# EAGLE design ln2block_6s (EAGLE 7.6.0)
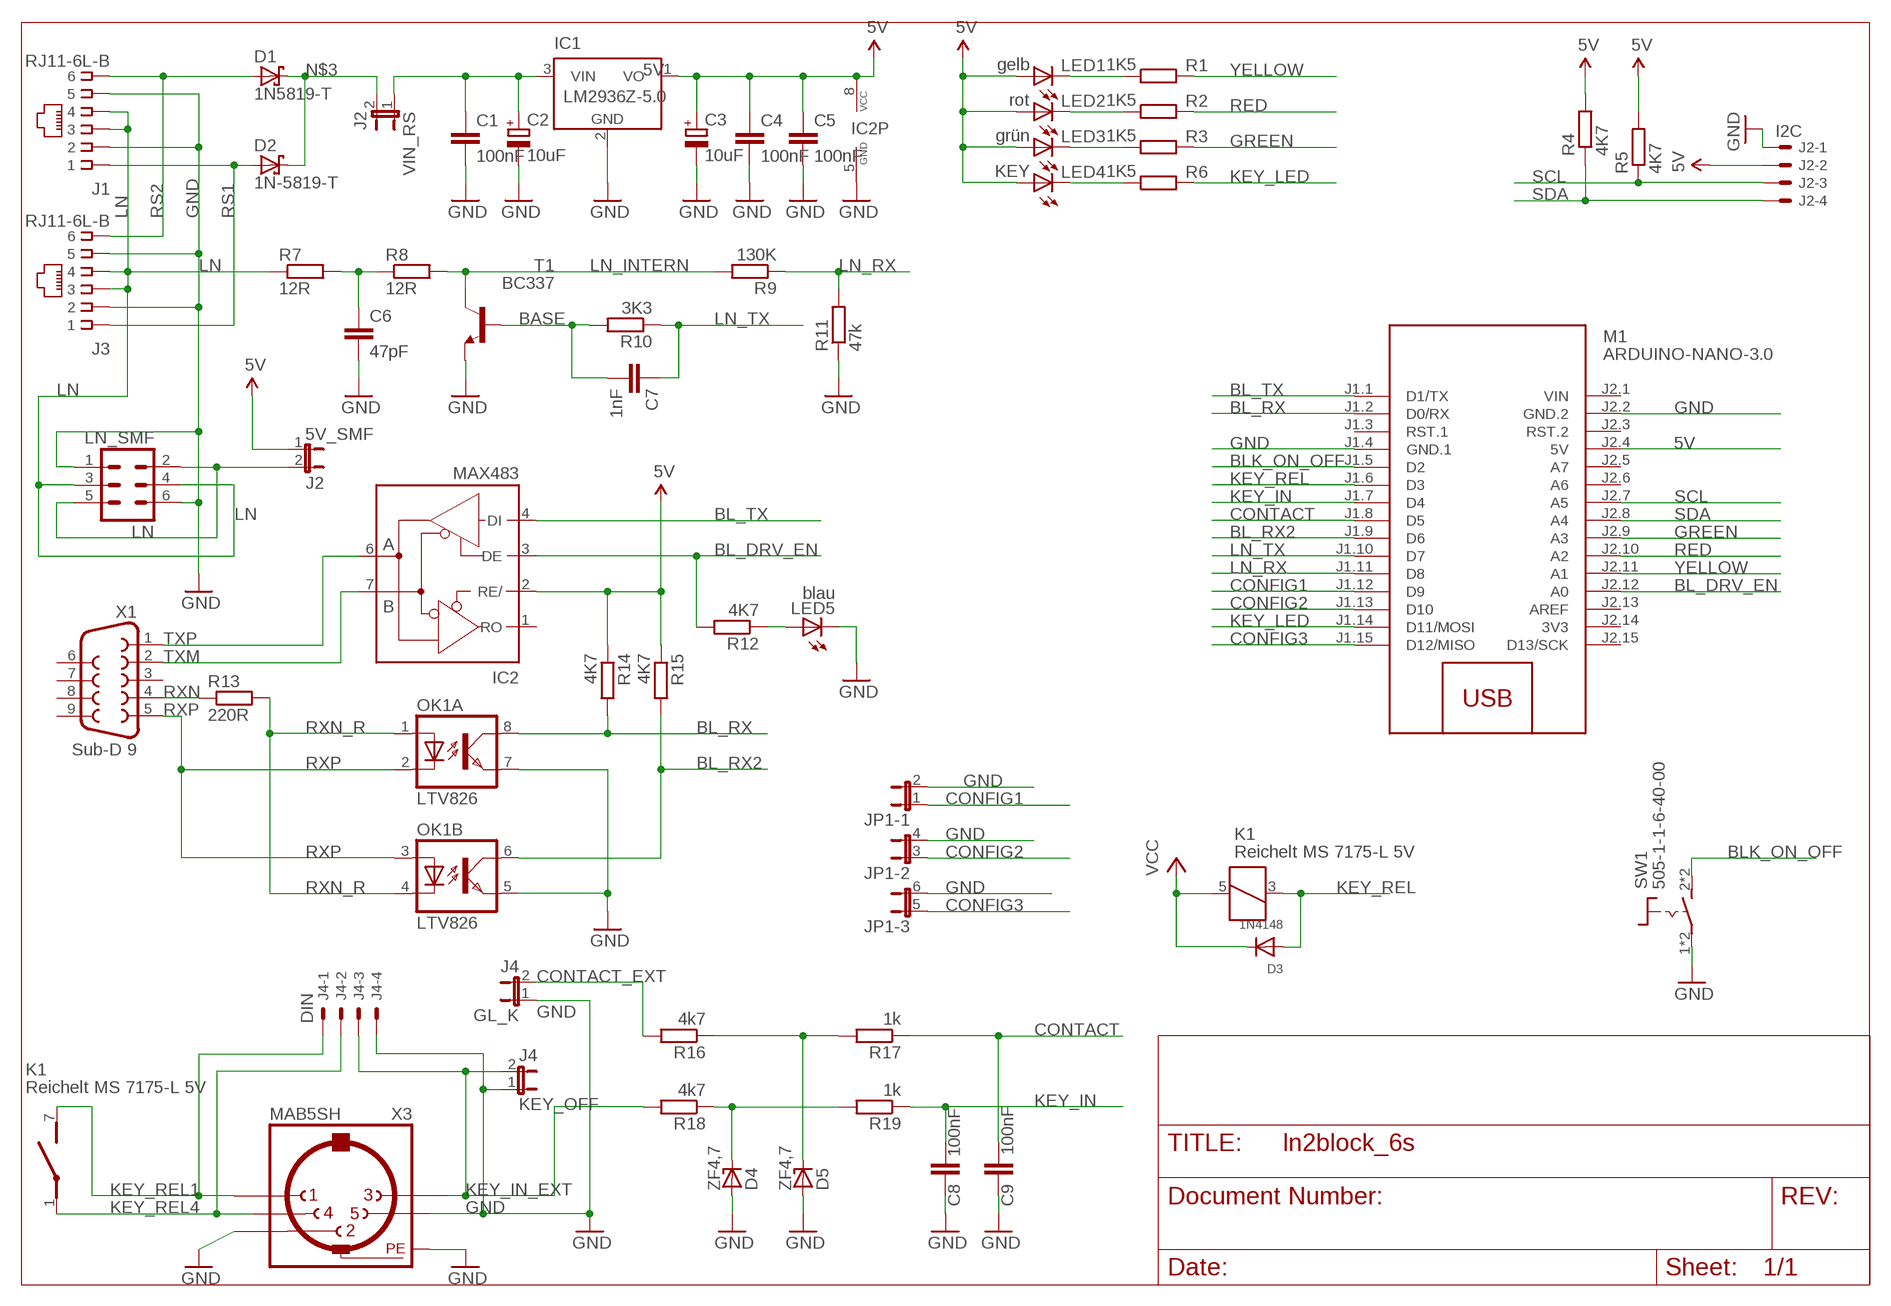
[diagram p0: schematic, sheet 1]

## Parts
5V_SMF  J2  JP1E  [JP1]
C1  100nF  C-EU025-025X050  [C025-025X050]
C2  10uF  CPOL-EUE2.5-5  [E2,5-5]
C3  10uF  CPOL-EUE2.5-5  [E2,5-5]
C4  100nF  C-EU025-025X050  [C025-025X050]
C5  100nF  C-EU025-025X050  [C025-025X050]
C6  47pF  C-EU025-024X044  [C025-024X044]
C7  1nF  C-EU025-025X050  [C025-025X050]
C8  100nF  C-EU025-025X050  [C025-025X050]
C9  100nF  C-EU025-025X050  [C025-025X050]
D1  1N5819-T  [DO41-7.6]
D2  1N-5819-T  1N5819-T  [DO41-7.6]
D3  1N4148  DIODEDO-1N4148  [DO-1N4148]
D4  ZF4,7  ZENER-DIODEZD-7.5  [ZDIO-7.5]
D5  ZF4,7  ZENER-DIODEZD-7.5  [ZDIO-7.5]
GL_K  J4  JP1E  [JP1]
IC1  LM2936Z-5.0  [TO92]
IC2  MAX483  MAX481CPA  [DIL08]
J1  RJ11-6L-B  [RJ11-NO_SHIELD]
J2  I2C  22-27-2041-04  [6410-04]
J3  RJ11-6L-B  [RJ11-NO_SHIELD]
J4  DIN  22-27-2041-04  [6410-04]
JP1  JP3QE  [JP3Q]
K1  Reichelt MS 7175-L 5V  MEDER_MSVV_1A87-75  [MEDER_MS_1A87-75L]
KEY_OFF  J4  JP1E  [JP1]
LED1  gelb  LED3MM  [LED3MM]
LED2  rot  LED3MM  [LED3MM]
LED3  grün  LED3MM  [LED3MM]
LED4  KEY  LED3MM  [LED3MM]
LED5  blau  LED3MM  [LED3MM]
LN  LN_SMF  CON-HARTING-ML_ML6  [CON-HARTING-ML_ML6]
M1  ARDUINO-NANO-3.0  [ARDUINO-NANO-3.0]
OK1  LTV826  [DIL08]
R1  1K5  R-EU_0207/7  [0207/7]
R2  1K5  R-EU_0207/7  [0207/7]
R3  1K5  R-EU_0207/7  [0207/7]
R4  4K7  R-EU_0207/7  [0207/7]
R5  4K7  R-EU_0207/7  [0207/7]
R6  1K5  R-EU_0207/7  [0207/7]
R7  12R  R-EU_0207/7  [0207/7]
R8  12R  R-EU_0207/7  [0207/7]
R9  130K  R-EU_0207/7  [0207/7]
R10  3K3  R-EU_0207/7  [0207/7]
R11  47k  R-EU_0207/7  [0207/7]
R12  4K7  R-EU_0207/7  [0207/7]
R13  220R  R-EU_0207/7  [0207/7]
R14  4K7  R-EU_0207/7  [0207/7]
R15  4K7  R-EU_0207/7  [0207/7]
R16  4k7  R-EU_0207/7  [0207/7]
R17  1k  R-EU_0207/7  [0207/7]
R18  4k7  R-EU_0207/7  [0207/7]
R19  1k  R-EU_0207/7  [0207/7]
SW1  505-1-1-6-40-00  TACTILE_SWITCH_505-1-1-6-40-00_6X6MM  [WS-TATV]
T1  BC337  [TO92]
VIN_RS  J2  JP1E  [JP1]
X1  Sub-D 9  F09HP  [F09HP]
X3  MAB5SH  [MAB5SH]

## Nets
5V: 5V_SMF.1 C3.+ C4.1 C5.1 D3.C IC1.1(VO) IC2.2(RE/) IC2.8(VCC) J2.2 K1.5 LED1.A LED2.A LED3.A LED4.A M1.J2.4(5V) R4.2 R5.2 R14.1 R15.1 ; supply symbol labelled VCC
BASE: C7.2 R10.2 T1.2(B)
BL_DRV_EN: IC2.3(DE) M1.J2.12(A0) R12.2
BL_RX: M1.J1.2(D0/RX) OK1.8(A:COL) R14.2
BL_RX2: M1.J1.9(D6) OK1.6(B:COL) R15.2
BL_TX: IC2.4(DI) M1.J1.1(D1/TX)
BLK_ON_OFF: M1.J1.5(D2) SW1.2(S) SW1.4(S)
CONFIG1: JP1.1 M1.J1.12(D9)
CONFIG2: JP1.3 M1.J1.13(D10)
CONFIG3: JP1.5 M1.J1.15(D12/MISO)
CONTACT: C9.2 M1.J1.8(D5) R17.1
CONTACT_EXT: GL_K.2 R16.2
GND: C1.2 C2.- C3.- C4.2 C5.2 C6.2 C8.1 C9.1 D4.A D5.A GL_K.1 IC1.2(GND) IC2.5(GND) J1.2 J1.5 J2.1 J3.2 J3.5 J4.4 JP1.2 JP1.4 JP1.6 KEY_OFF.1 LED5.K(C) LN.1 LN.6 M1.J1.4(GND.1) M1.J2.2(GND.2) OK1.5(B:EMIT) OK1.7(A:EMIT) R11.1 SW1.1(P) SW1.3(P) T1.1(E) X3.5 X3.PE X3.PE1(PE) X3.PE2(PE) X3.PE@(PE)
GREEN: M1.J2.9(A3) R3.2
KEY_IN: C8.2 M1.J1.7(D4) R19.1
KEY_IN_EXT: J4.3 KEY_OFF.2 R18.2 X3.3
KEY_LED: M1.J1.14(D11/MOSI) R6.2
KEY_REL: D3.A K1.3 M1.J1.6(D3)
KEY_REL1: J4.1 K1.7(2:S) X3.1
KEY_REL4: J4.2 K1.1(2:P) X3.4
LN: J1.3 J1.4 J3.3 J3.4 LN.3 LN.4 R7.1
LN_INTERN: R8.2 R9.2 T1.3(C)
LN_PLUS: C1.1 C2.+ IC1.3(VIN) VIN_RS.1
LN_RX: M1.J1.11(D8) R9.1 R11.2
LN_TX: C7.1 M1.J1.10(D7) R10.1
N$1: LED4.K(C) R6.1
N$2: LED5.A R12.1
N$3: D1.C D2.C VIN_RS.2
N$4: 5V_SMF.2 LN.2 LN.5
N$6: D4.C R18.1 R19.2
N$7: C6.1 R7.2 R8.1
N$8: D5.C R16.1 R17.2
N$21: LED1.K(C) R1.1
N$23: LED2.K(C) R2.1
N$24: LED3.K(C) R3.1
RED: M1.J2.10(A2) R2.2
RS1: D2.A J1.1 J3.1
RS2: D1.A J1.6 J3.6
RXN: R13.1 X1.4
RXN_R: OK1.1(A:A) OK1.4(B:C) R13.2
RXP: OK1.2(A:C) OK1.3(B:A) X1.5
SCL: J2.3 M1.J2.7(A5) R5.1
SDA: J2.4 M1.J2.8(A4) R4.1
TXM: IC2.7(B) X1.2
TXP: IC2.6(A) X1.1
YELLOW: M1.J2.11(A1) R1.2
Unconnected: IC2.1(RO) M1.J1.3(RST.1) M1.J2.3(RST.2) M1.J2.5(A7) M1.J2.6(A6) M1.J2.13(AREF) M1.J2.15(D13/SCK) X1.3 X1.6 X1.7 X1.8 X1.9 X3.2

## Power pins joined to a net without a drawn wire
3V3: M1.J2.14(3V3)
VIN: M1.J2.1(VIN)

## Library data of the parts
5V_SMF GL_K KEY_OFF VIN_RS = jumper:JP1E: JUMPER
C1 C4-C9 = resistor:C-EU: CAPACITOR, European symbol
C2 C3 = resistor:CPOL-EU: POLARIZED CAPACITOR, European symbol
D1 D2 = diode:1N581*: 1.0A SCHOTTKY BARRIER RECTIFIER Source: http://www.diodes.com/datasheets/ds23001.pdf
D3 = adafruit:DIODE: Diode SMADIODE - SMA Surface Mount Package 20V 1A Schottky Diode Digikey: 641-1014-6-ND DO-1N4148 - Through Hole Small Current Diode SOD-123 20V 1 A (.5mV Vf) Schottky Diode - Digikey: MBRX120TPMSCT-ND SOD-323 10V 570mA (.38mV Vf, 3ns) Schottky Diode - Digikey: ZLLS410CT-ND SOD-523 30V 30mA Schottky Diode (RB751S-40TE61) - Digikey: RB751S-40TE61CT-ND SOT23-R/W - SOT23 Package (R = Solder Paste/Reflow Ovens, W = Hand-Soldering) BAT54Film 40V 300mA - Digikey: 497-7162-1-ND
D4 D5 = diode:ZENER-DIODE: Z-Diode
IC1 = national-semiconductor:LM2936?*: Ultra-Low Quiescent Current LDO Voltage Regulator Source: Data sheet <http://www.national.com/ds/LM/LM2936.pdf>; MF: NATIONAL SEMICONDUCTOR; MPN: LM2936Z-5.0/NOPB; OC_FARNELL: 1150143; OC_NEWARK: 41K4533
IC2 = maxim:MAX481CPA: RS485 TRANSEIVER; MPN: MAX481CPA+; OC_FARNELL: unknown; OC_NEWARK: 99K3445
J1 J3 = con-tycoelectronics:RJ11: CORCOM Modular RJ Jacks No Shield Source: www.tycoelectronics.com .. ENG_DS_1654001_1099_RJ_L_0507.pdf; MF: TYCO ELECTRONICS; MPN: RJ11-6L-B; OC_FARNELL: unknown; OC_NEWARK: 52K3613
J2 J4 = con-molex:22-?-04: CONNECTOR wire to board 2.54 mm (.1 inch) pitch header; OC_FARNELL: unknown; OC_NEWARK: unknown
JP1 = jumper:JP3QE: JUMPER
K1 = sbor:MEDER_MSVV_1A87-75: RELAY reed, 1 x norm. open with polarity; OC_FARNELL: unknown; OC_NEWARK: unknown
LED1-LED5 = led:LED: LED OSRAM: - CHIPLED LG R971, LG N971, LY N971, LG Q971, LY Q971, LO R971, LY R971 LH N974, LH R974 LS Q976, LO Q976, LY Q976 LO Q996 - Hyper CHIPLED LW Q18S LB Q993, LB Q99A, LB R99A - SideLED LS A670, LO A670, LY A670, LG A670, LP A670 LB A673, LV A673, LT A673, LW A673 LH A674 LY A675 LS A676, LA A676, LO A676, LY A676, LW A676 LS A679, LY A679, LG A679 - Hyper Micro SIDELED® LS Y876, LA Y876, LO Y876, LY Y876 LT Y87S - SmartLED LW L88C, LW L88S LB L89C, LB L89S, LG L890 LS L89K, LO L89K, LY L89K LS L896, LA L896, LO L896, LY L896 - TOPLED LS T670, LO T670, LY T670, LG T670, LP T670 LSG T670, LSP T670, LSY T670, LOP T670, LYG T670 LG T671, LOG T671, LSG T671 LB T673, LV T673, LT T673, LW T673 LH T674 LS T676, LA T676, LO T676, LY T676, LB T676, LH T676, LSB T676, LW T676 LB T67C, LV T67C, LT T67C, LS T67K, LO T67K, LY T67K, LW E67C LS E67B, LA E67B, LO E67B, LY E67B, LB E67C, LV E67C, LT E67C LW T67C LS T679, LY T679, LG T679 LS T770, LO T770, LY T770, LG T770, LP T770 LB T773, LV T773, LT T773, LW T773 LH T774 LS E675, LA E675, LY E675, LS T675 LS T776, LA T776, LO T776, LY T776, LB T776 LHGB T686 LT T68C, LB T68C - Hyper Mini TOPLED® LB M676 - Mini TOPLED Santana® LG M470 LS M47K, LO M47K, LY M47K Source: http://www.osram.convergy.de LUXEON: - LUMILED® LXK2-PW12-R00, LXK2-PW12-S00, LXK2-PW14-U00, LXK2-PW14-V00 LXK2-PM12-R00, LXK2-PM12-S00, LXK2-PM14-U00 LXK2-PE12-Q00, LXK2-PE12-R00, LXK2-PE12-S00, LXK2-PE14-T00, LXK2-PE14-U00 LXK2-PB12-K00, LXK2-PB12-L00, LXK2-PB12-M00, LXK2-PB14-N00, LXK2-PB14-P00, LXK2-PB14-Q00 LXK2-PR12-L00, LXK2-PR12-M00, LXK2-PR14-Q00, LXK2-PR14-R00 LXK2-PD12-Q00, LXK2-PD12-R00, LXK2-PD12-S00 LXK2-PH12-R00, LXK2-PH12-S00 LXK2-PL12-P00, LXK2-PL12-Q00, LXK2-PL12-R00 Source: www.luxeon.com KINGBRIGHT: KA-3528ASYC Source: www.kingbright.com
LN = _relaisblock2Gl-Frontplatte:CON-HARTING-ML_ML6: HARTING
M1 = diy-modules:ARDUINO-NANO-3.0: Arduino Nano 3.0
OK1 = optocoupler:LTV826: OPTO COUPLER Source: LITEON, LTV816.pdf; OC_FARNELL: unknown; OC_NEWARK: unknown
R1-R19 = resistor:R-EU_: RESISTOR, European symbol
SW1 = fredi:TACTILE_SWITCH: Tactile Switch; BE#: 1144
T1 = transistor:BC337: NPN TRANSISTOR
X1 = con-subd:F09: SUB-D; OC_FARNELL: unknown; OC_NEWARK: unknown
X3 = _djk:MAB5SH: Female CONNECTOR 5 pins 90 deg. with shield, horizontal (DIN 41524); OC_FARNELL: 809883; OC_NEWARK: unknown

## Board
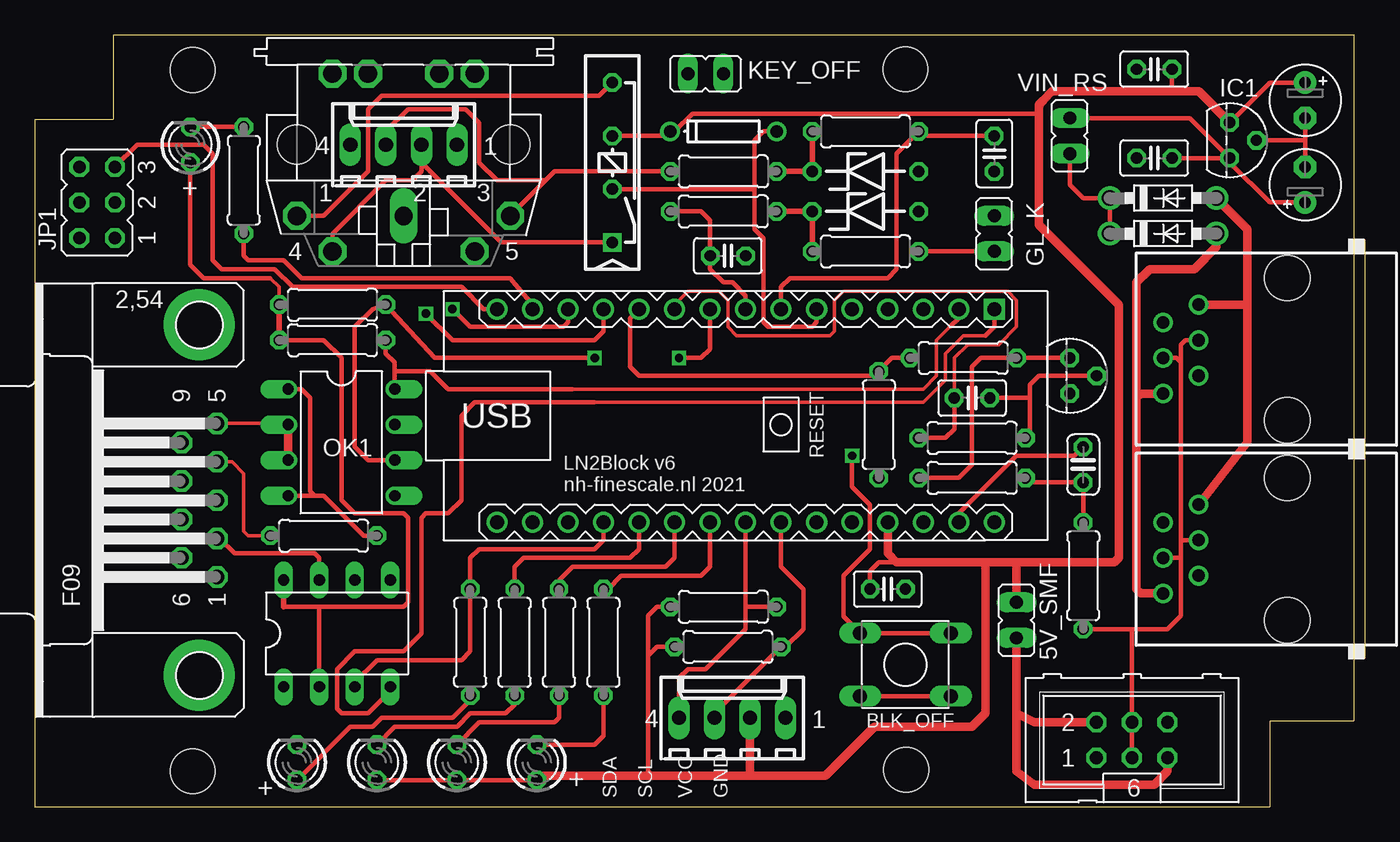
[diagram p1: board, top side]
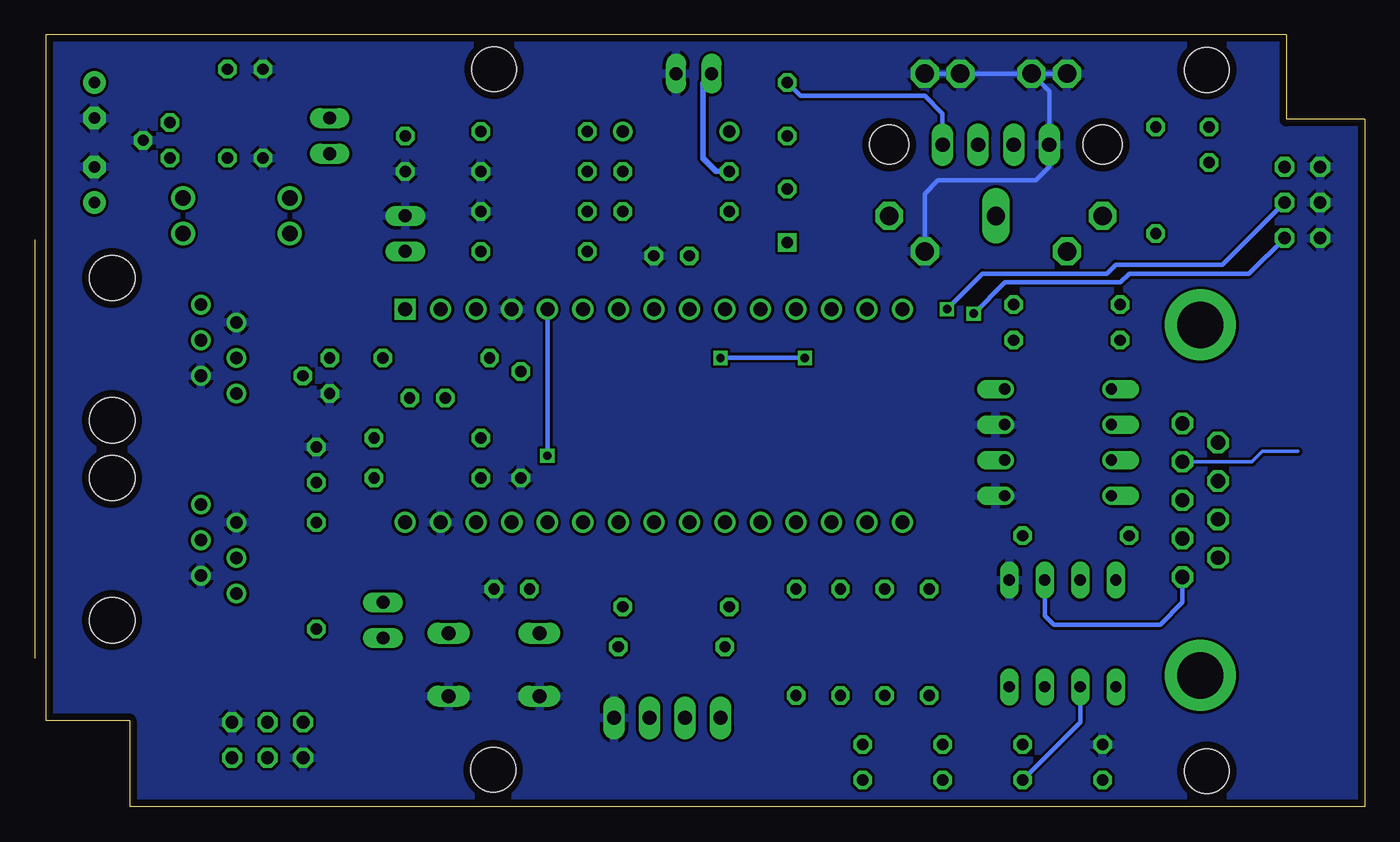
[diagram p2: board, bottom side, seen from below]

Size 94.28 x 55.15 mm. Coordinates in mm from the lower left corner, seen from the top.
Outline: 0,0 88.28,0 88.28,6.15 94.28,6.15 94.28,55.15 5.59,55.15 5.59,49.12 0,49.12 0,0
Copper layers (1*16): Top 0.035mm / dielectric 1.5mm / Bottom 0.035mm
Design rules "dj-eagle": minimum track width 10mil, minimum drill 20mil, track to track 8mil, track to pad 8mil, pad to pad 8mil, via to via 8mil, smd to smd 8mil, copper to edge 20mil, drill to drill 8mil, minimum pad ring 10mil, minimum via ring 8mil, stop-mask expansion 4mil, vias tented up to drill 0mil, thermal gap 10mil
Holes 3.2 mm at 62.28,2.65 62.23,52.7 11.29,2.54 11.29,52.65

### Footprints (pad centres in the part's own frame; a part is rotated, then mirrored left to right if it is on the bottom)
JP1 = drill 0.914 long: 1 0,-1.27; 2 0,1.27
C025-025X050 = drill 0.813 octagon: 1 -1.27,0; 2 1.27,0
E2,5-5 = drill 0.813 pad 1.6: + -1.27,0 | drill 0.813 pad 1.6 octagon: - 1.27,0
C025-024X044 = drill 0.813 octagon: 1 -1.27,0; 2 1.27,0
DO41-7.6 = drill 1.1 pad 1.7: A 3.81,0; C -3.81,0
DO-1N4148 = drill 0.9: A -3.81,0; C 3.81,0
ZDIO-7.5 = drill 0.813 octagon: A 3.81,0; C -3.81,0
TO92 = drill 0.813 pad 1.27 octagon: 1 -1.27,0; 2 0,1.905; 3 1.27,0
DIL08 = drill 0.813 long: 1 -3.81,-3.81; 2 -1.27,-3.81; 3 1.27,-3.81; 4 3.81,-3.81; 5 3.81,3.81; 6 1.27,3.81; 7 -1.27,3.81; 8 -3.81,3.81
RJ11-NO_SHIELD = drill 0.9 pad 1.4: 1 -3.175,8.89; 2 -1.905,6.35; 3 -0.635,8.89; 4 0.635,6.35; 5 1.905,8.89; 6 3.175,6.35 | hole 3.251: -5.08,0; 5.08,0
6410-04 = drill 1.016 long: 1 3.81,0; 2 1.27,0; 3 -1.27,0; 4 -3.81,0
JP3Q = drill 0.914 octagon: 1 -2.54,-1.27; 2 -2.54,1.27; 3 0,-1.27; 4 0,1.27; 5 2.54,-1.27; 6 2.54,1.27
MEDER_MS_1A87-75L = drill 0.813 square: 1 0,0 | drill 0.813 octagon: 3 3.81,0; 5 7.62,0; 7 11.43,0
LED3MM = drill 0.813 octagon: A -1.27,0; K 1.27,0
CON-HARTING-ML_ML6 = drill 0.914 octagon: 1 -2.54,-1.27; 2 -2.54,1.27; 3 0,-1.27; 4 0,1.27; 5 2.54,-1.27; 6 2.54,1.27
ARDUINO-NANO-3.0 = drill 1 square: J1.1 17.78,7.62 | drill 1: J1.2 15.24,7.62; J1.3 12.7,7.62; J1.4 10.16,7.62; J1.5 7.62,7.62; J1.6 5.08,7.62; J1.7 2.54,7.62; J1.8 0,7.62; J1.9 -2.54,7.62; J1.10 -5.08,7.62; J1.11 -7.62,7.62; J1.12 -10.16,7.62; J1.13 -12.7,7.62; J1.14 -15.24,7.62; J1.15 -17.78,7.62; J2.1 17.78,-7.62; J2.2 15.24,-7.62; J2.3 12.7,-7.62; J2.4 10.16,-7.62; J2.5 7.62,-7.62; J2.6 5.08,-7.62; J2.7 2.54,-7.62; J2.8 0,-7.62; J2.9 -2.54,-7.62; J2.10 -5.08,-7.62; J2.11 -7.62,-7.62; J2.12 -10.16,-7.62; J2.13 -12.7,-7.62; J2.14 -15.24,-7.62; J2.15 -17.78,-7.62
DIL08' = drill 0.813 offset: 1 -3.81,-3.81; 2 -1.27,-3.81; 3 1.27,-3.81; 4 3.81,-3.81; 5 3.81,3.81; 6 1.27,3.81; 7 -1.27,3.81; 8 -3.81,3.81
0207/7 = drill 0.813 octagon: 1 -3.81,0; 2 3.81,0
WS-TATV = drill 1 long: 1 -3.25,2.25; 2 -3.25,-2.25; 3 3.25,2.25; 4 3.25,-2.25
TO92' = drill 0.813 octagon: 1 1.27,0; 2 0,1.905; 3 -1.27,0
F09HP = drill 1.016 octagon: 1 -5.486,-1.27; 2 -2.743,-1.27; 3 0,-1.27; 4 2.743,-1.27; 5 5.486,-1.27; 6 -4.115,1.27; 7 -1.372,1.27; 8 1.372,1.27; 9 4.115,1.27 | drill 3.302 pad 5.08: G1 -12.522,0; G2 12.522,0
MAB5SH = drill 1.321 octagon: 1 7.62,5.08; 3 -7.62,5.08; 4 5.08,7.62; 5 -5.08,7.62; PE -2.54,-5.08; PE1 -5.08,-5.08; PE2 5.08,-5.08; PE@ 2.54,-5.08 | drill 1.321 long: 2 0,5.08 | hole 2.794: 7.62,0; -7.62,0

### Placement (x,y rotation side)
5V_SMF  70.17,13.33 180 top
C1  80.01,46.35 180 top
C2  90.8,44.45 90 top
C3  90.8,50.48 270 top
C4  80.01,52.7 180 top
C5  60.96,15.56 0 top
C6  74.93,24.45 90 top
C7  66.99,29.21 0 top
C8  68.58,46.67 90 top
C9  49.53,39.37 180 top
D1  80.64,43.5 0 top
D2  80.64,40.96 0 top
D3  49.21,48.26 180 top
D4  59.37,45.4 0 top
D5  59.37,42.55 0 top
GL_K  68.58,40.96 180 top
IC1  85.41,47.62 270 top
IC2  21.59,12.38 0 top
J1  89.53,32.7 90 top
J2  49.85,6.35 0 top
J3  89.53,18.41 90 top
J4  26.35,47.31 0 top
JP1  4.45,43.18 90 top
K1  41.28,40.32 90 top
KEY_OFF  47.94,52.39 90 top
LED1  24.45,3.18 90 top
LED2  30.16,3.18 90 top
LED3  35.88,3.18 90 top
LED4  11.11,47.31 90 top
LED5  18.73,3.18 90 top
LN  78.42,4.76 0 top
M1  50.8,27.94 0 top
OK1  LTV826  [DIL08']  21.91,26.03 270 top
R1  34.29,11.75 90 top
R2  37.47,11.75 90 top
R3  40.64,11.75 90 top
R4  49.21,14.29 180 top
R5  49.53,11.43 180 top
R6  14.92,44.77 270 top
R7  74.93,16.51 90 top
R8  66.99,23.49 180 top
R9  66.36,32.07 0 top
R10  66.99,26.35 0 top
R11  60.33,27.3 90 top
R12  31.11,11.75 90 top
R13  20.64,19.37 0 top
R14  21.27,33.34 0 top
R15  21.27,35.88 0 top
R16  59.37,39.69 0 top
R17  49.21,42.55 0 top
R18  49.21,45.4 180 top
R19  59.37,48.26 180 top
SW1  62.23,10.16 180 top
T1  BC337  [TO92']  73.98,30.8 270 top
VIN_RS  73.98,47.94 180 top
X1  11.75,21.91 90 top
X3  26.35,47.31 180 top

### Tracks (layer width: path | path; a pad name or v marks a point on that pad's centre or on a via)
5V
  Top 0.254: 16.83,37.78 17.46,37.15 R15.1
  Top 0.305: LED1.A LED2.A LED3.A | C3.+ 88.27,51.75 IC1.1 | C4.1 81.28,51.12 | K1.5 44.77,47.94 D3.C 45.72,48.26 46.99,49.53 71.75,49.53 72.07,50.48 73.02,51.12 | R14.1 20.64,33.34 21.91,32.07 21.91,21.91 22.86,20.95 26.35,20.95 26.67,20.64 26.67,14.6 26.35,14.29 20.32,14.29 | 20.32,14.29 17.78,14.29 | IC2.2 20.32,14.29 | 61.59,17.46 60.33,17.46 59.69,16.83 C5.1 | LED4.A 11.11,38.73 12.07,37.78 16.83,37.78 | R5.2 44.45,11.43 43.81,10.79 | 43.81,10.79 43.81,2.54 44.13,2.22 | R4.2 44.45,14.29 43.81,13.65 43.81,10.79
  Top 0.406: R15.1 R14.1 | IC2.8 17.78,14.29
  Top 0.61: 67.94,17.46 70.17,17.46 | 70.17,17.46 77.15,17.46 77.47,17.78 77.47,35.88 71.75,41.59 71.75,49.53 71.75,50.16 72.07,50.48 72.71,51.12 73.02,51.12 81.28,51.12 83.19,51.12 IC1.1 | 5V_SMF.1 70.17,17.46 | 51.12,2.22 44.13,2.22 36.19,2.22 LED3.A | 51.12,2.22 56.52,2.22 60.01,5.71 66.99,5.71 67.94,6.67 67.94,17.46 | 67.94,17.46 61.59,17.46 60.96,18.1 M1.J2.4 | J2.2 51.12,2.22
  Bottom 0.305: IC2.2 20.32,6.03 LED1.A
BASE
  Top 0.305: T1.2 71.75,30.8 71.12,30.16 71.12,29.21 | 71.12,29.21 71.12,26.67 R10.2 | C7.2 71.12,29.21
BL_DRV_EN
  Top 0.305: IC2.3 22.86,8.89 24.45,10.48 30.48,10.48 31.11,11.11 R12.2 31.11,17.78 31.75,18.41 40,18.41 40.64,19.05 M1.J2.12
BL_RX
  Top 0.254: 38.42,29.84 63.5,29.84 64.45,30.8 64.45,33.34 65.41,34.29
  Top 0.305: 65.41,34.29 66.04,34.92 M1.J1.2 | R14.2 25.08,32.38 25.72,31.75 25.72,31.12 | 25.72,31.12 OK1.8 | 38.42,29.84 29.53,29.84 28.26,31.12 25.72,31.12
BL_RX2  (via drill 0.6)
  Top 0.305: OK1.6 23.81,24.77 22.86,25.72 22.86,34.29 24.13,35.56 R15.2 28.57,32.07 v40,32.07 | v46.04,32.07 47.62,32.07 48.26,32.7 M1.J1.9
  Bottom 0.305: v40,32.07 v46.04,32.07
BL_TX
  Top 0.254: 67.94,33.66 66.36,33.66 65.09,32.38 65.09,30.48 63.5,28.89 40,28.89
  Top 0.305: 40,28.89 31.43,28.89 30.48,27.94 30.48,21.91 29.53,20.95 27.94,20.95 27.62,20.64 27.62,12.38 26.35,11.11 22.86,11.11 21.59,9.84 21.59,6.99 21.91,6.67 23.81,6.67 25.4,8.26 IC2.4 | 67.94,33.66 68.58,34.29 M1.J1.1
BLK_ON_OFF  (via drill 0.6)
  Top 0.305: v58.42,25.08 58.42,22.86 59.69,21.59 59.69,18.41 57.78,16.51 57.78,13.6 SW1.4 SW1.2
  Bottom 0.305: M1.J1.5 v58.42,25.08
CONFIG1  (via drill 0.6)
  Top 0.305: v27.94,35.24 29.85,33.34 40,33.34 40.64,33.97 M1.J1.12
  Bottom 0.305: v27.94,35.24 25.72,37.46 17.46,37.46 16.83,38.1 8.26,38.1 JP1.1
CONFIG2  (via drill 0.6)
  Top 0.305: M1.J1.13 38.1,34.61 37.78,34.29 31.11,34.29 v29.85,35.56
  Bottom 0.305: v29.85,35.56 27.31,38.1 18.41,38.1 17.78,38.73 10.16,38.73 JP1.3
CONFIG3
  Top 0.305: M1.J1.15 32.07,35.56 30.48,37.15 18.41,37.15 17.14,38.42 13.34,38.42 12.7,39.05 12.7,46.67 12.07,47.31 7.3,47.31 JP1.5
CONTACT
  Top 0.305: R17.1 47.62,42.55 48.26,41.91 C9.2 48.26,38.42 49.21,37.46 49.85,37.46 50.8,36.51 M1.J1.8
CONTACT_EXT
  Top 0.305: R16.2 GL_K.2
GND
  Top 0.305: 66.04,20.95 70.17,25.08 74.3,25.08 C6.2 | SW1.3 SW1.1 | C3.- 90.8,47.62 | 90.8,47.62 C2.- | IC1.2 90.8,47.62
  Bottom 0.305: X3.PE@ 22.54,51.12 J4.4 22.54,45.72 23.5,44.77 30.48,44.77 31.43,43.81 X3.5 | X3.PE1 X3.PE X3.PE@ | X3.PE2 X3.PE@
  pour Bottom: 0.32,0.32 0.32,48.89 6.03,48.89 6.03,54.93 93.98,54.93 93.98,6.03 88.27,6.03 88.27,0.32
GREEN
  Top 0.305: R3.2 40.96,15.56 41.91,16.51 47.62,16.51 48.26,17.15 M1.J2.9
KEY_IN
  Top 0.305: C8.2 63.82,47.94 R19.1 61.59,46.67 61.59,38.42 60.96,37.78 53.97,37.78 53.34,37.15 M1.J1.7
KEY_IN_EXT
  Top 0.305: R18.2 37.15,45.4 36.51,44.77 | 36.51,44.77 X3.3 | J4.3 25.08,48.26 26.67,49.85 30.8,49.85 31.75,48.89 31.75,46.04 33.02,44.77 36.51,44.77
  Bottom 0.406: R18.2 46.36,45.4 47.31,46.35 47.31,51.75 KEY_OFF.2
KEY_LED
  Top 0.305: M1.J1.14 35.56,35.88 33.97,37.78 19.05,37.78 17.78,39.05 15.24,39.05 14.92,39.37 R6.2
KEY_REL
  Top 0.305: M1.J1.6 55.88,34.61 55.56,34.29 52.39,34.29 52.07,34.61 52.07,40.64 51.44,41.27 51.44,44.13 | 51.44,44.13 51.44,47.62 52.07,48.26 D3.A | K1.3 51.44,44.13
KEY_REL1
  Top 0.305: X3.1 20.64,42.23 23.81,45.4 23.81,49.85 24.77,50.8 40.32,50.8 K1.7
  Bottom 0.305: J4.1 30.16,49.53 31.43,50.8 40.32,50.8 K1.7
KEY_REL4
  Top 0.305: X3.4 21.27,40.96 25.08,44.77 26.99,44.77 27.62,45.4 27.62,46.04 | 27.62,46.04 J4.2 | K1.1 33.34,40.32 27.62,46.04
LN
  Top 0.305: LN.3 LN.4 78.42,12.7 | 81.91,17.78 81.91,19.05 | 81.91,19.05 81.91,31.75 | 81.91,31.75 81.6,32.07 J1.3 | J1.4 82.23,33.34 81.91,33.02 81.91,31.75 | R7.1 78.42,12.7 | 78.42,12.7 80.96,12.7 81.91,13.65 81.91,17.78 | J3.3 81.91,17.78 | J3.4 81.91,19.05
LN_INTERN
  Top 0.305: R8.2 66.04,23.49 66.99,24.45 66.99,31.43 67.63,32.07 R9.2 T1.3
LN_PLUS
  Top 0.305: IC1.3 85.41,46.04 88.27,43.18 C2.+ | IC1.3 C1.1 | VIN_RS.1 82.55,49.21 IC1.3
LN_RX
  Top 0.305: 43.18,35.24 M1.J1.11 42.55,34.92 42.55,31.43 43.18,30.8 59.69,30.8 R11.2 61.28,32.07 R9.1
LN_TX
  Top 0.254: M1.J1.10 45.72,35.88 46.67,36.83 48.89,36.83 49.53,36.2 49.53,34.29 50.17,33.66 56.83,33.66 57.15,33.97 57.15,36.2 57.78,36.83 69.53,36.83 70.17,36.2 70.17,34.29 68.9,33.02 66.67,33.02 65.72,32.07 65.72,28.57
  Top 0.305: C7.1 65.72,28.57 65.72,26.99 65.09,26.35 R10.1
N$1
  Top 0.305: LED4.K R6.1
N$2
  Top 0.305: R12.1 31.11,7.62 29.85,6.35 24.77,6.35 24.13,5.71 22.54,5.71 LED5.A
N$3
  Top 0.305: D2.C D1.C 74.93,43.5 73.98,44.45 VIN_RS.2
N$4
  Top 0.61: 5V_SMF.2 70.17,6.67 | 70.17,6.67 71.44,6.03 LN.2 | LN.5 80.96,2.54 80.01,1.59 71.44,1.59 70.17,2.54 70.17,6.67
N$6
  Top 0.406: R19.2 D4.C R18.1
N$7
  Top 0.305: R7.2 C6.1 71.44,23.18 R8.1
N$8
  Top 0.406: R17.2 D5.C R16.1
N$21
  Top 0.305: R1.1 34.29,7.3 33.66,6.67 31.11,6.67 30.16,5.71 25.72,5.71 LED1.K
N$23
  Top 0.305: R2.1 37.47,6.35 37.15,6.03 31.75,6.03 LED2.K
N$24
  Top 0.305: LED3.K 40,4.45 40.64,5.08 R3.1
RED
  Top 0.305: R2.2 37.47,16.19 38.42,17.15 45.08,17.15 45.72,17.78 M1.J2.10
RS1
  Top 0.61: D2.A 84.45,40 82.87,38.42 79.69,38.42 78.74,37.46 78.74,29.21 | 78.74,29.21 78.74,15.56 79.06,15.24 J3.1 | J1.1 79.06,29.53 78.74,29.21
RS2
  Top 0.61: 86.68,35.88 86.68,41.27 D1.A | 86.68,35.88 86.68,26.03 J3.6 | J1.6 86.68,35.88
RXN
  Top 0.254: X1.4 14.08,24.65 14.92,23.81 14.92,19.69 15.24,19.37 R13.1
  Bottom 0.254: X1.4 8.05,24.65 7.3,25.4 4.76,25.4
RXN_R
  Top 0.305: R13.2 23.5,19.37 20.64,22.23 20,22.23 | 20,22.23 OK1.4 | OK1.1 19.05,29.84 19.68,29.21 19.68,22.54 20,22.23
RXP
  Top 0.254: X1.5 17.69,27.39 OK1.2
  Top 0.61: OK1.2 OK1.3
SCL
  Top 0.305: J2.3 48.58,6.67 R5.1 53.66,11.43 54.93,12.7 54.93,15.56 53.34,17.15 M1.J2.7
SDA
  Top 0.305: M1.J2.8 50.8,14.29 | 50.8,14.29 50.8,12.7 47.94,9.84 46.67,9.84 46.04,9.21 J2.4 | R4.1 50.8,14.29
TXM
  Top 0.305: 20.32,16.83 IC2.7 20.32,17.78 20,18.1 14.29,18.1 13.22,19.16 X1.2
TXP
  Top 0.305: X1.1 6.12,16.42
  Bottom 0.305: IC2.6 22.86,13.65 22.23,13.02 14.61,13.02 13.02,14.6 X1.1
YELLOW
  Top 0.305: R1.2 34.29,17.15 34.92,17.78 42.55,17.78 43.18,18.41 M1.J2.11

### Text on the board
tNames: + | LN2Block v6 / nh-finescale.nl 2021 | BLK_OFF | + | + | SDA | SCL | VCC | GND